# Altium schematic sheet jetson_agx_breakout.SchDoc: CAN Bus HAT
size B; Date: 12/22/2022; Author: Cole Tucker; Organization: ORGANIZATION; Address1: ADDRESS 1; Address2: ADDRESS 2; Address3: ADDRESS 3; Address4: ADDRESS 4; Revision: -; SheetNumber: 1; SheetTotal: 1; ENG_APP_DATE: --/--/--; DSN_APP_DATE: --/--/--; CHK_APP_DATE: --/--/--
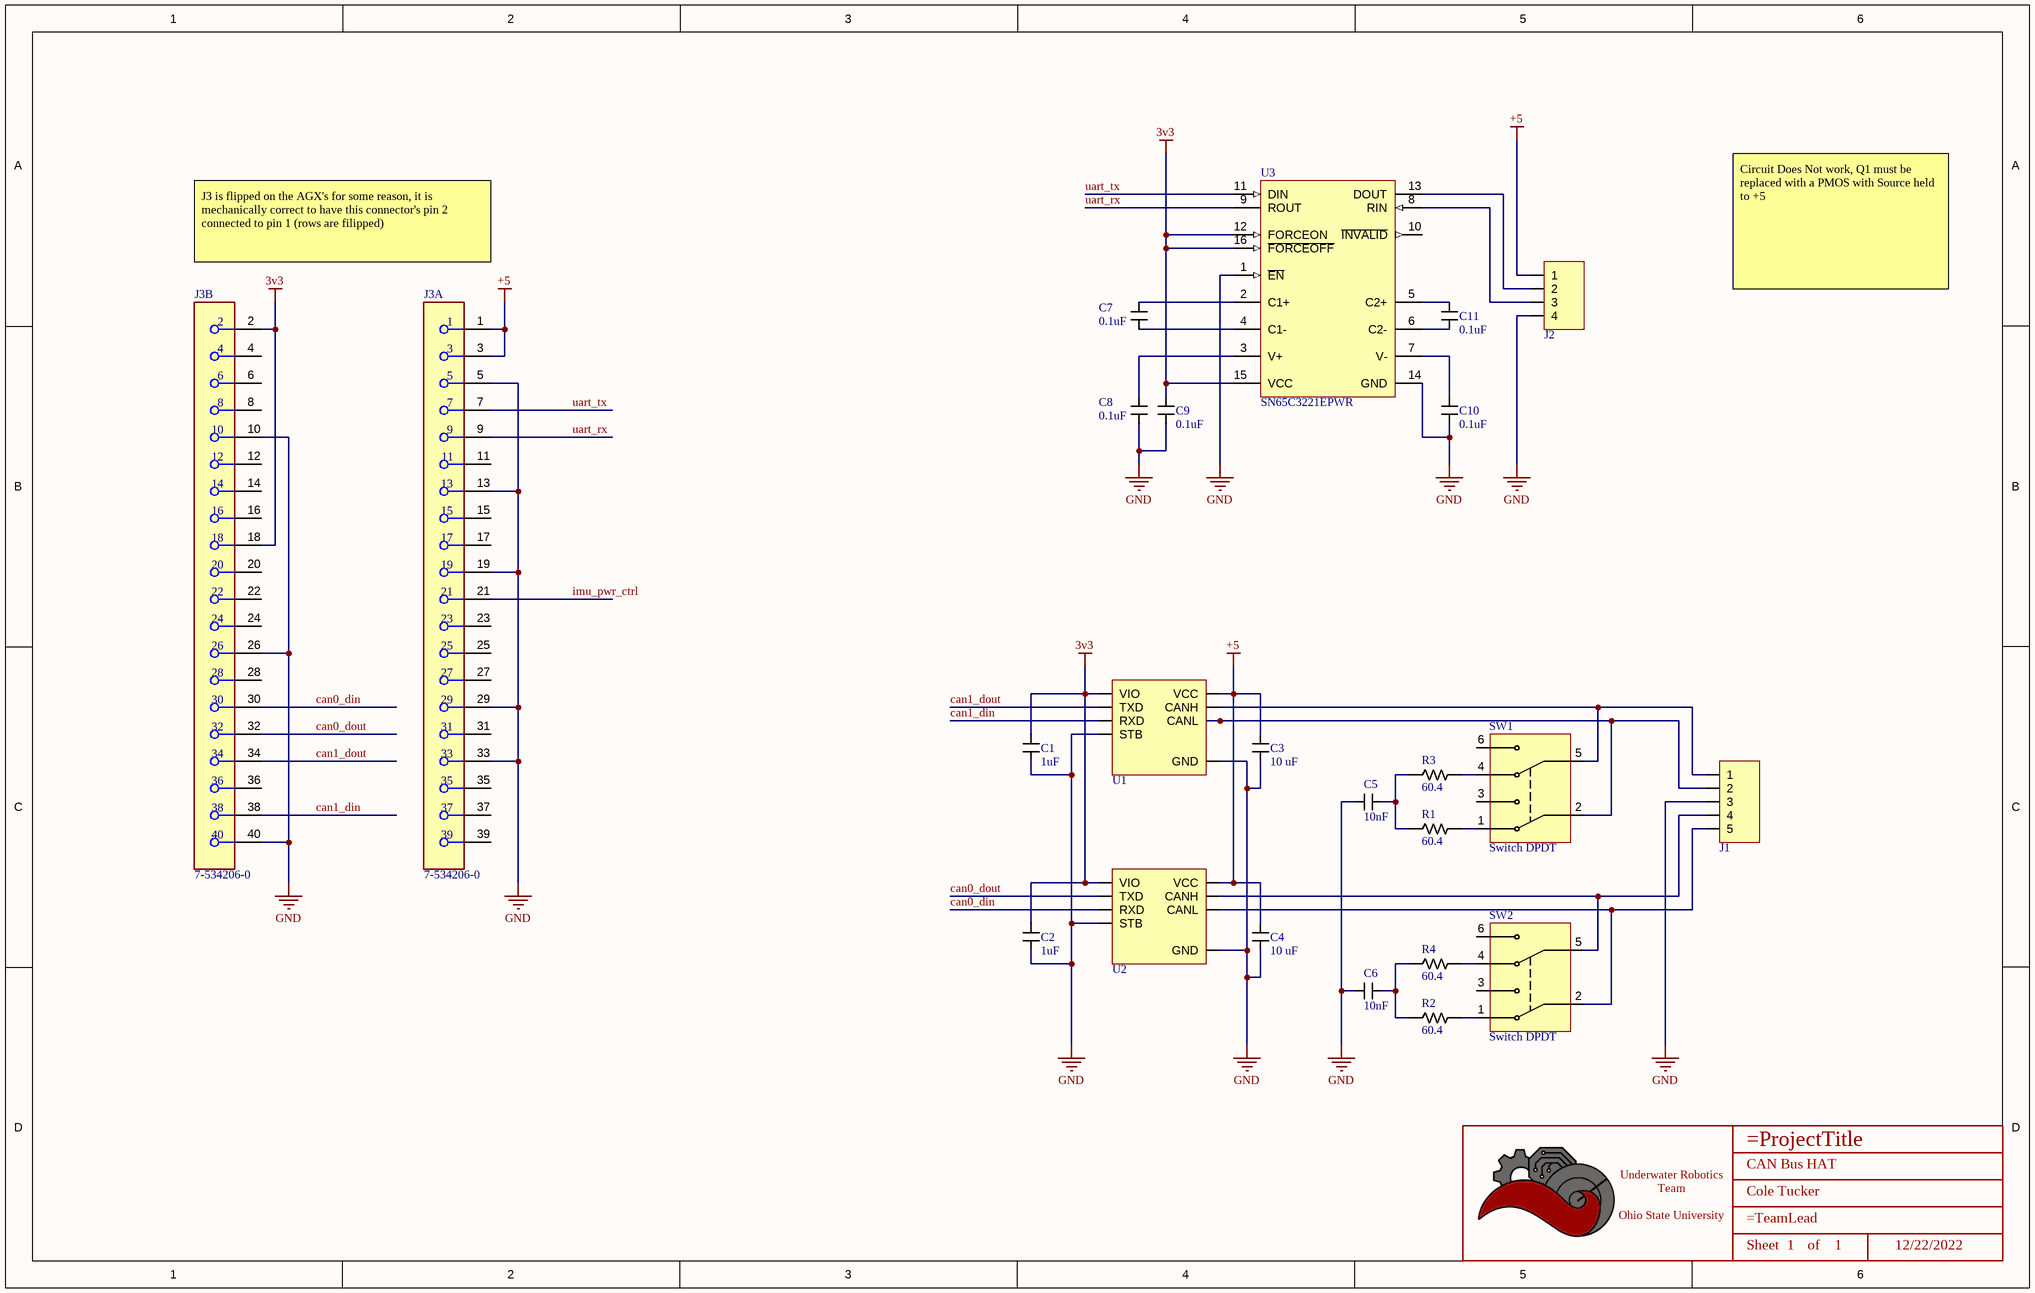
[diagram p0: jetson_agx_breakout.SchDoc]

## Parts
*  Title_Block  [LOGO]  (value not drawn)  (graphical)
C1  value 1uF  [CAPACITOR_0603]  (hidden comment: 1uF Ceramic 16V)
C2  value 1uF  [CAPACITOR_0603]  (hidden comment: 1uF Ceramic 16V)
C3  Value (uF): 10 uF  [CAPACITOR_0603]  (hidden comment: 10uF Ceramic 6.3V)
C4  Value (uF): 10 uF  [CAPACITOR_0603]  (hidden comment: 10uF Ceramic 6.3V)
C5  value 10nF  [CAPACITOR_0603]  (hidden comment: 10nF Ceramic 6.3V)
C6  value 10nF  [CAPACITOR_0603]  (hidden comment: 10nF Ceramic 6.3V)
C7  value 0.1uF  [CAPACITOR_0603]  (hidden comment: 100nF Ceramic 6.3V)
C8  value 0.1uF  [CAPACITOR_0603]  (hidden comment: 100nF Ceramic 6.3V)
C9  value 0.1uF  [CAPACITOR_0603]  (hidden comment: 100nF Ceramic 6.3V)
C10  value 0.1uF  [CAPACITOR_0603]  (hidden comment: 100nF Ceramic 6.3V)
C11  value 0.1uF  [CAPACITOR_0603]  (hidden comment: 100nF Ceramic 6.3V)
J1  XH2.54 VERT  [CONN_JST_XH254_5POS_VERT]  (value not drawn)
J2  XH2.54 VERT  [CONN_JST_XH254_4POS_VERT]  (value not drawn)
J3  7-534206-0  [FP-7-534206-0-MFG]  (parts A,B of 2)
R1  Value  (Ohms): 60.4  [RESISTOR_0402]  (hidden comment: 60.4 Ohm 1% 1/16W)
R2  Value  (Ohms): 60.4  [RESISTOR_0402]  (hidden comment: 60.4 Ohm 1% 1/16W)
R3  Value  (Ohms): 60.4  [RESISTOR_0402]  (hidden comment: 60.4 Ohm 1% 1/16W)
R4  Value  (Ohms): 60.4  [RESISTOR_0402]  (hidden comment: 60.4 Ohm 1% 1/16W)
SW1  Switch DPDT  [CAS-220TA]
SW2  Switch DPDT  [CAS-220TA]
U1  CAN Transceiver  [SOIC-8]  (value not drawn)
U2  CAN Transceiver  [SOIC-8]  (value not drawn)
U3  SN65C3221EPWR  [PW0016A_M]

## Nets
3v3: C1.1 C2.1 C9.1 J3.2 J3.18 U1.5(VIO) U2.5(VIO) U3.12(FORCEON) U3.15(VCC) U3.16(~{FORCEOFF})
+5: C3.1 C4.1 J2.1 J3.1 J3.3 U1.3(VCC) U2.3(VCC)
GND: C1.2 C2.2 C3.2 C4.2 C5.1 C6.1 C8.2 C9.2 C10.2 J1.3 J2.4 J3.5 J3.10 J3.13 J3.19 J3.26 J3.29 J3.33 J3.40 U1.2(GND) U1.8(STB) U2.2(GND) U2.8(STB) U3.1(~{EN}) U3.14(GND)
can0_din: J3.30 U2.4(RXD)
can0_dout: J3.32 U2.1(TXD)
can1_din: J3.38 U1.4(RXD)
can1_dout: J3.34 U1.1(TXD)
imu_pwr_ctrl: J3.21
uart_rx: J3.9 U3.9(ROUT)
uart_tx: J3.7 U3.11(DIN)
NetC5_2: C5.2 R1.2 R3.2
NetC6_2: C6.2 R2.2 R4.2
NetC7_1: C7.1 U3.2(C1+)
NetC7_2: C7.2 U3.4(C1-)
NetC8_1: C8.1 U3.3(V+)
NetC10_1: C10.1 U3.7(V-)
NetC11_1: C11.1 U3.5(C2+)
NetC11_2: C11.2 U3.6(C2-)
NetJ1_1: J1.1 SW1.5 U1.7(CANH)
NetJ1_2: J1.2 SW1.2 U1.6(CANL)
NetJ1_4: J1.4 SW2.5 U2.7(CANH)
NetJ1_5: J1.5 SW2.2 U2.6(CANL)
NetJ2_2: J2.2 U3.13(DOUT)
NetJ2_3: J2.3 U3.8(RIN)
NetR1_1: R1.1 SW1.1
NetR2_1: R2.1 SW2.1
NetR3_1: R3.1 SW1.4
NetR4_1: R4.1 SW2.4

Not connected (* = marked no-connect by the designer): J3 4 6 8 11 12 14 15 16 17 20 22 23 24 25 27 28 31 35 36 37 39; SW1 3 6; SW2 3 6; U3 10(~{INVALID})

## Notes on the sheet
- J3 is flipped on the AGX's for some reason, it is mechanically correct to have this connector's pin 2 connected to pin 1 (rows are filipped)
- Circuit Does Not work, Q1 must be replaced with a PMOS with Source held to +5
- DWG. NO.
- REV.
- SHT.
- THIS DOCUMENT AND THE DATA DISCLOSED HEREIN OR HEREWITH IS THE PROPERTY OF ALTIUM LIMITED AND MAY BE FREELY DISTRIBUTED IN WHOLE. NO RIGHTS ARE RESERVED OR EXPRESS OR IMPLIED WARANTEE GIVEN.
- REVISION
- DESCRIPTION
- DATE
- APPROVED
- ENG:
- APPROVALS
- PROJECT
- DSN:
- CHK:
- REFERENCE DOCUMENTS
- PROJECT REVISION:
- TITLE
- DOCUMENT REVISION:
- DESIGN ITEM:
- BOM:
- FAB DWG:
- PCB DWG:
- ASSY DWG:
- SCALE:
- SIZE
- B
- CAGE CODE
- FILE NAME
- DWG NO.
- SHEET
- OF
- REV
- (in symbol Title_Block) Underwater Robotics Team / Ohio State University; Sheet; of

## Library data of the parts
* = Title_Block: UWRT Schematic Title Block Template / Created June 2021, Dylan Trainor
C1 C2 = CAPACITOR_1uF_0603: Cap 1uF 16V +/-10% / Ceramic 0603; Made By: Flip B; Tolerance: +/- 10%; Voltage: 16V; Supplier 1: Digi-Key; Supplier Part Number 1: 399-7847-1-ND
C3 C4 = CAPACITOR_10uF_0603: Cap 10uF 6.3V +/-20% / Ceramic 0603; Made By: Flip B; ComponentLink1Description: Digikey; ComponentLink1URL: https://www.digikey.com/en/products/detail/samsung-electro-mechanics/CL10A106MQ8NNNC/3886777; Supplier 1: Digi-Key; Supplier Part Number 1: 1276-1119-1-ND; Tolerance: +/- 20%; Voltage: 6.3V
C5 C6 = CAPACITOR_0.01uF_0603: Cap 10nF 6.3V +/-20% / Ceramic 0603; Tolerance: +/- 10%; Made By: Flip B; ComponentLink1Description: Datsheet; ComponentLink1URL: https://www.mouser.com/datasheet/2/212/KEM_C1002_X7R_SMD-1102033.pdf; Voltage: 6.3V; Supplier 1: Mouser; Supplier Part Number 1: 80-C0603C103K9R
C7-C11 = CAPACITOR_0.1uF_0603: Cap 100nF 6.3V +/-10% / Ceramic 0603; Made By: Flip B; ComponentLink1Description: Datsheet; ComponentLink1URL: https://www.mouser.com/datasheet/2/212/KEM_C1002_X7R_SMD-1102033.pdf; Tolerance: +/- 10%; Voltage: 6.3V; Supplier 1: Digi-Key; Supplier Part Number 1: 399-15351-1-ND
J1 = CONN_JST_XH254_5POS_VERT: JST XH 2.54mm Pitch 5 Pos Vertical; Current Per Pin: 4A; Number of Positions: 5; NOTE: Do not use JST 2.5mm parts with this footprint. JST does not make 2.54mm pitch pins, rather only clones make this connector!; Manufacturer: JST; Pitch: 2.54mm; Configuration: Vertical; Color: White; Created By: Robert P; Series: XH 2.54; ComponentLink1Description: Purchase Link; ComponentLink1URL: https://www.amazon.com/460PCS-XH2-54-Connector-Terminal-Connectors/dp/B09DBGVX5C
J2 = CONN_JST_XH254_4POS_VERT: JST XH 2.54mm Pitch 4 Pos Vertical; Current Per Pin: 4A; Number of Positions: 4; NOTE: Do not use JST 2.5mm parts with this footprint. JST does not make 2.54mm pitch pins, rather only clones make this connector!; Manufacturer: JST; Pitch: 2.54mm; Configuration: Vertical; Color: White; Created By: Robert P; Series: XH 2.54; ComponentLink1Description: Purchase Link; ComponentLink1URL: https://www.amazon.com/460PCS-XH2-54-Connector-Terminal-Connectors/dp/B09DBGVX5C
J3 = CMP-03369-000068-1: CONN RCPT 40POS 0.1 GOLD PCB; Manufacturer: TE Connectivity; Standoff Height: 0.38mm; Voltage Rating: 333V; Conn Orientation: Vertical; Is Female: yes; Pitch: 2.54mm; Number Of Contacts: 40; Current Rating: 2A; Conn Gender: Female; Temperature: -65°C to +105°C; Temperature Range High: +105°C; Temperature Range Low: -65°C; Package: 7-534206-0; Lead Free: Yes; Manufacturer Part Number: 7-534206-0; Contact Material: Gold,Nickel; Device Class L2: Headers and Wire Housings; RoHS: TRUE; Number Of Rows: 2; Octopart: https://octopart.com/7-534206-0-te+connectivity-39516831; Device Class L3: unset; Device Class L1: Connectors; Mouser Description: Headers & Wire Housings REC 2X20P VRT T/H; ComponentLink2URL: https://octopart.com/datasheet/7-534206-0-te+connectivity-39516831; ComponentLink2Description: Datasheet; Digikey Description: CONN RCPT 40POS 0.1 GOLD PCB; Footprint Url: https://www.mouser.in/datasheet/2/418/NG_CD_534206_R7-1252933.pdf; Category: Conn; Height: 8.9mm; Automotive: No
R1-R4 = RESISTOR_60.4_0402: RES 60.4 OHM 1% 1/16W 0402; Tolerance: +/- 1%; Made By: Robert Pafford; Wattage: 1/16W; Supplier: Digikey; Digikey Part Numer: CR0603-JW-104ELFTR-ND; Supplier 1: Digi-Key; Supplier Part Number 1: 13-AC0402FR-0760R4LCT-ND
SW1 SW2 = CAS-220TA_CAN_TERM: GOLD SWITCH FLUSH SLIDE DPDT 100MA 6V; Made By: Robert Pafford; Voltage Rating: 6VDC; Current Rating: 100 mA; Switch Function: DPDT; Contact Finish: Gold; Supplier 1: Digi-Key; Supplier Part Number 1: CAS220JCT-ND
U1 U2 = TJA1442AT: CAN Interface IC High-Speed CAN Transceiver with Standby Mode; Made By: Robert Pafford; Max Data Rate: 5Mbps; Supplier 1: Mouser; Supplier Part Number 1: 771-TJA1442AT/0Z
U3 = CMP-0299-01595-2: 3-V to 5.5-V Single-Channel RS-232 1-Mbit/s Line Driver / Receiver with ±15-kV IEC ESD Protection, -40 to 85 degC, 16-Pin SSOP (DB), Green (RoHS & no Sb/Br); ICC(Max)(mA): 1; ESD HBM(kV): +/-15; Single Supply: TRUE; Supply Voltage(s)(V): 3.3 or 5.0; PackageVersion: revG, Feb-2011; PackageReference: PW0016A; ComponentLink3Description: Package Specification; Drivers Per Package: 1; ComponentLink3URL: http://www.ti.com/litv/pdf/mpds361; Receivers Per Package: 1; IEC-61000-4-2 SUPPORT: TRUE; SubFamily: RS-232; ComponentLink1Description: Manufacturer URL; DatasheetVersion: SLLS694B; ComponentLink2Description: Datasheet; ComponentLink2URL: http://www.ti.com/general/docs/lit/getliterature.tsp?genericPartNumber=SN65C3221E&fileType=pdf; ComponentLink1URL: www.ti.com; RS-232: TRUE; PackageDescription: 16-Pin Plastic Thin Small Outline Package 5 x 4.4 mm Body ,0.65 mm Pitch